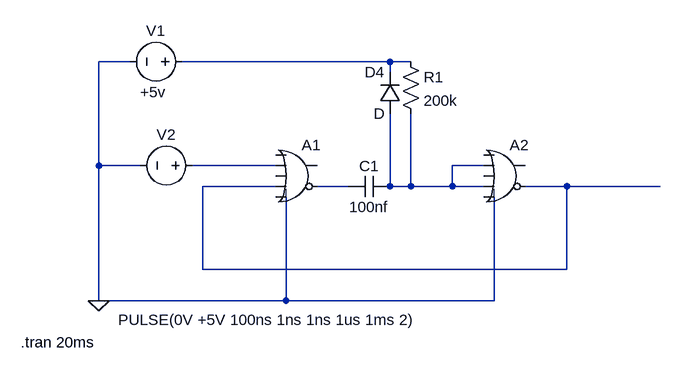
[diagram p0: schematic Monostable.asc]
Monostable.asc, the LTspice schematic file:
Version 4
SHEET 1 880 680
WIRE -192 16 -240 16
WIRE 208 16 -112 16
WIRE 240 16 208 16
WIRE 208 32 208 16
WIRE -240 176 -240 16
WIRE -176 176 -240 176
WIRE 32 176 -96 176
WIRE 352 176 304 176
WIRE 32 208 -80 208
WIRE 144 208 96 208
WIRE 208 208 208 96
WIRE 240 208 240 96
WIRE 240 208 208 208
WIRE 304 208 304 176
WIRE 304 208 240 208
WIRE 352 208 304 208
WIRE 480 208 416 208
WIRE 624 208 480 208
WIRE -80 336 -80 208
WIRE 480 336 480 208
WIRE 480 336 -80 336
WIRE -240 384 -240 176
WIRE 48 384 48 224
WIRE 48 384 -240 384
WIRE 368 384 368 224
WIRE 368 384 48 384
FLAG -240 384 0
SYMBOL Digital\\or 64 128 R0
SYMATTR InstName A1
SYMATTR SpiceLine VHigh=+5v
SYMATTR SpiceLine2 Trise=7ns Td=11ns
SYMBOL Digital\\or 384 128 R0
SYMATTR InstName A2
SYMATTR SpiceLine VHigh=+5V
SYMATTR SpiceLine2 Trise=11ns Td=7ns
SYMBOL res 224 0 R0
SYMATTR InstName R1
SYMATTR Value 200k
SYMBOL cap 208 192 R90
WINDOW 0 0 32 VBottom 2
WINDOW 3 32 32 VTop 2
SYMATTR InstName C1
SYMATTR Value 100nf
SYMBOL voltage -96 16 R90
WINDOW 0 -32 56 VBottom 2
WINDOW 3 62 60 VBottom 2
WINDOW 123 0 0 Left 0
WINDOW 39 0 0 Left 0
SYMATTR InstName V1
SYMATTR Value +5v
SYMBOL voltage -80 176 R90
WINDOW 0 -32 56 VBottom 2
WINDOW 3 222 -98 VTop 2
WINDOW 123 0 0 Left 0
WINDOW 39 0 0 Left 0
SYMATTR InstName V2
SYMATTR Value PULSE(0V +5V 100ns 1ns 1ns 1us 1ms 2)
SYMBOL diode 224 96 R180
WINDOW 0 24 64 Left 2
WINDOW 3 24 0 Left 2
SYMATTR InstName D4
TEXT -360 448 Left 2 !.tran 20ms

The netlist it stands for:
* Monostable.asc
A1 0 N002 0 N004 0 N005 0 0 OR VHigh=+5v Trise=7ns Td=11ns
A2 0 N003 0 N003 0 N004 0 0 OR VHigh=+5V Trise=11ns Td=7ns
R1 N001 N003 200k
C1 N003 N005 100nf
V1 N001 0 +5v
V2 N002 0 PULSE(0V +5V 100ns 1ns 1ns 1us 1ms 2)
D4 N003 N001 D
.model D D
.lib standard.dio
.tran 20ms
.backanno
.end